# Altium project DRS4.PrjPCB
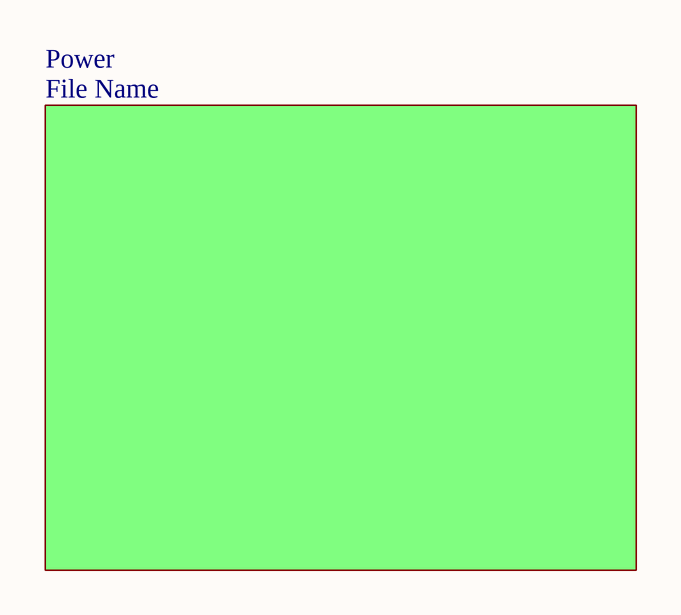
[diagram p0: UCLA-DRS4-TOP.SchDoc]
2 sheets, 1 parts. Net scope: global (net labels, ports and power ports of the same name join across sheets).
Sheets:
  UCLA-DRS4-TOP.SchDoc
  POWER.SchDoc

## Sheet UCLA-DRS4-TOP.SchDoc: UCLA-DRS4
size Letter; Organization: University of California; Address1: 475 Portola Plaza; Address2: Los Angeles, CA 90095; Revision: R01; SheetNumber: 1; SheetTotal: 1

### Sub-sheets
Power = File Name (file not in this document): no entries

### Notes on the sheet
- 475 Portola Plaza
- GAPS TOF
- Title
- igarcia91@g.ucla.edu
- Los Angeles, CA
- 310-825-0344
- Size:
- Date:
- Letter
- Number:
- Time:
- Sheet
- Revision:
- of
- andrew.peck@cern.ch
- spq@ucla.edu
- File:

## Sheet POWER.SchDoc: Power distribution
size Letter; Organization: University of California; Address1: 475 Portola Plaza; Address2: Los Angeles, CA 90095; Revision: R01; SheetNumber: 1; SheetTotal: 1
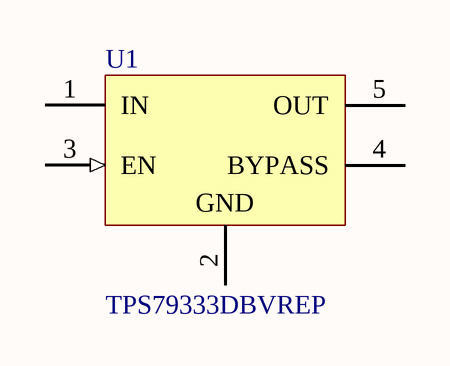
[diagram p1: POWER.SchDoc]

### Parts
U1  TPS79333DBVREP  [DBV0005A_M]

### Nets

Not connected (* = marked no-connect by the designer): U1 1(IN) 2(GND) 3(EN) 4(BYPASS) 5(OUT)

### Notes on the sheet
- 475 Portola Plaza
- GAPS TOF
- Title
- igarcia91@g.ucla.edu
- Los Angeles, CA
- 310-825-0344
- Size:
- Date:
- Letter
- Number:
- Time:
- Sheet
- Revision:
- of
- andrew.peck@cern.ch
- spq@ucla.edu
- File:

### Library data of the parts
U1 = CMP-0394-00316-2: Single Output Fast RF LDO, 200 mA, Fixed 3.3 V Output, 2.7 to 5.5 V Input, 5-pin SOT-23 (DBV), -40 to 125 degC, Green (RoHS & no Sb/Br); Manufacturer: Texas Instruments; Accuracy(%): 2; SubFamily: Single Channel LDO; Vin(Max)(V): 5.5; Fixed Output Options(V): 3.3; Vdo(Typ)(mV): 102; Iout(Max)(A): 0.2; Rating: HiRel Enhanced Product; Vin(Min)(V): 2.7; DatasheetVersion: SGLS163B; PackageVersion: 4073253-4/K; Code_JEDEC: MO-178; PackageDescription: 5-Pin Plastic Small Outline, Body 1.60 Ãƒâ€” 2.90 mm, Pitch 0.95 mm; ComponentLink1Description: Manufacturer URL; ComponentLink1URL: http://www.ti.com/; ComponentLink2Description: Datasheet; ComponentLink2URL: http://www.ti.com/general/docs/lit/getliterature.tsp?genericPartNumber=TPS79333-EP&fileType=pdf; ComponentLink3URL: http://www.ti.com/litv/pdf/mpds018i; Mounting Technology: Surface Mount; PartNumber: TPS79333DBVREP; Vout Adj(Min)(V): 3.3; PackageReference: DBV0005A; Iq(Typ)(mA): 0.2; Vout Adj(Max)(V): 3.3; Eco-Plan: Green (RoHS & no Sb/Br); ComponentLink3Description: Package Specification